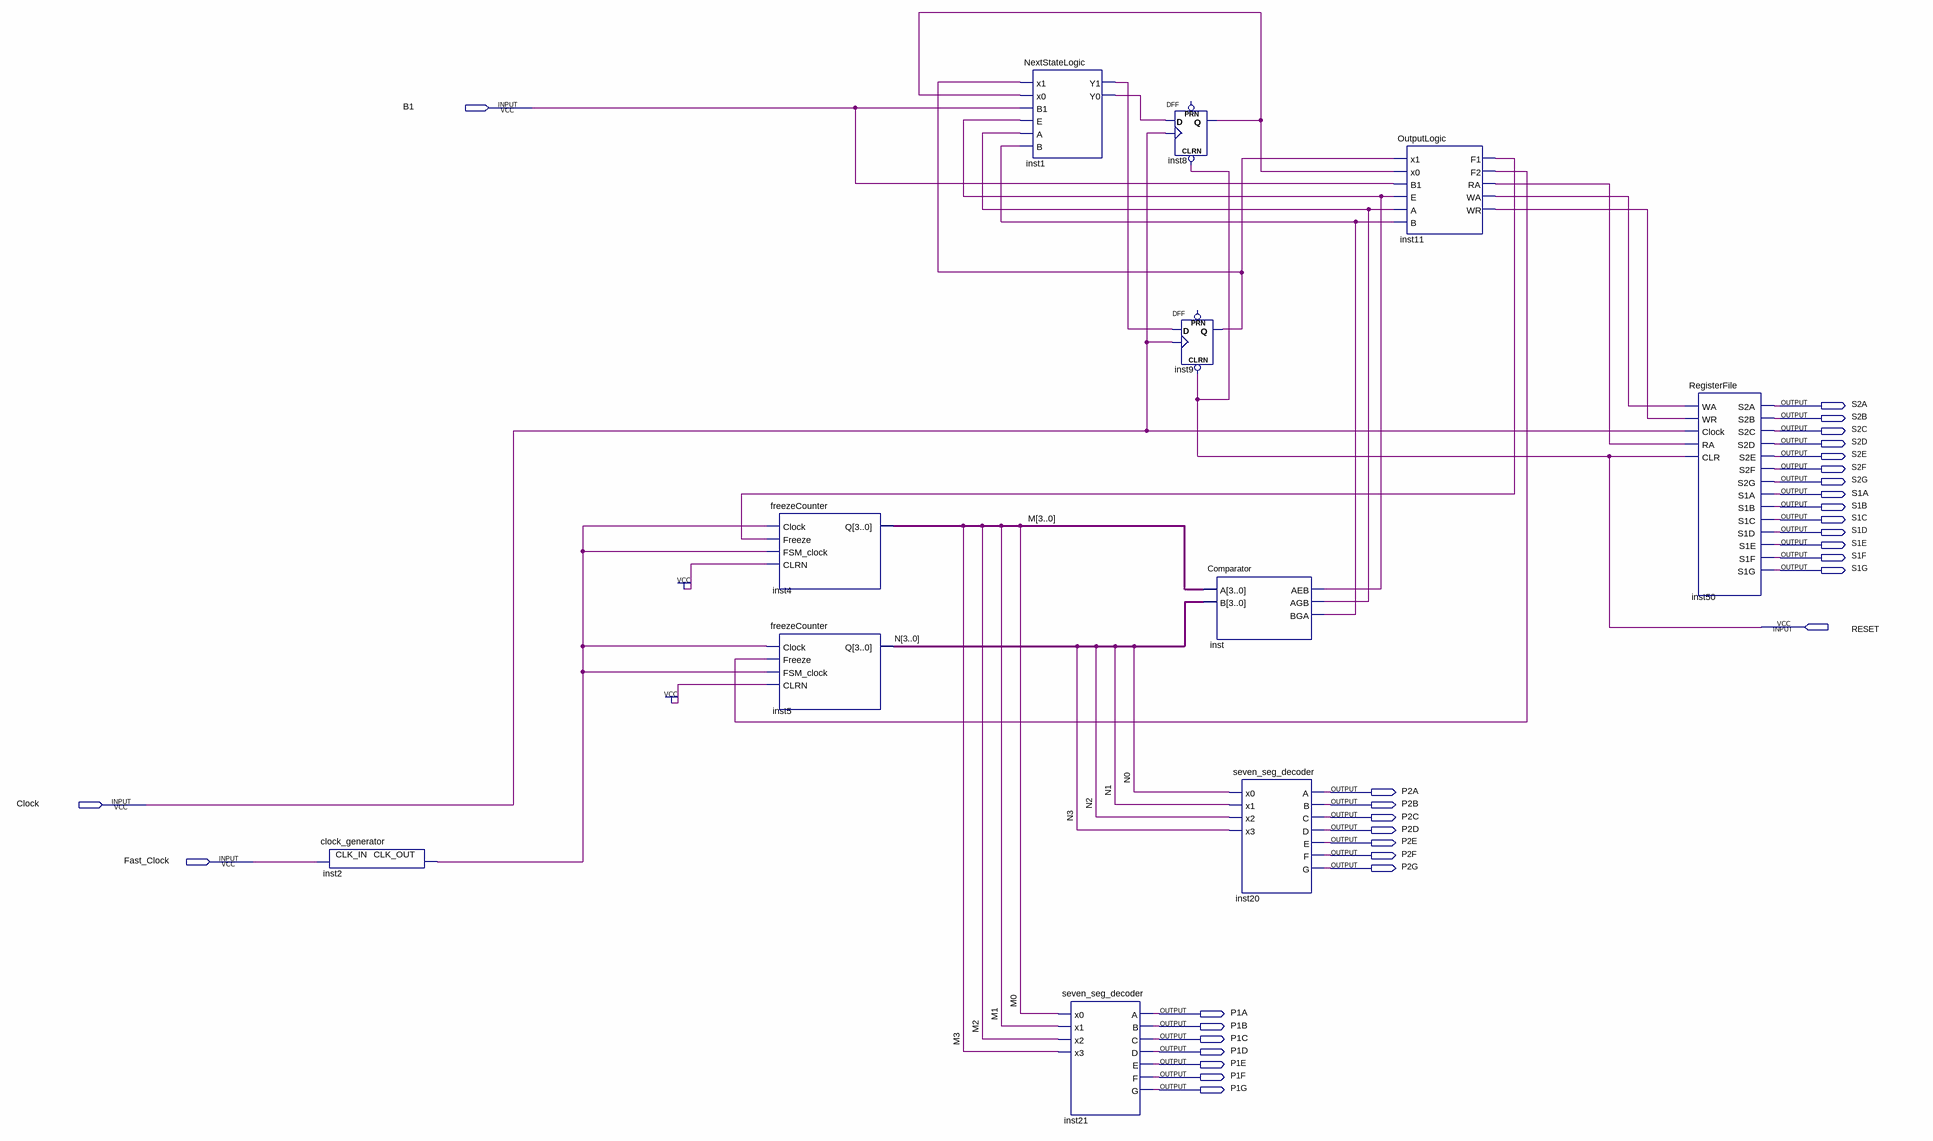
[diagram p0: schematic sheet]
// Quartus schematic Main.bdf as structural Verilog: 11 symbols, 32 pins
module Main (
  input  B1,
  input  RESET,
  input  Clock,
  input  Fast_Clock,
  output S2A,
  output S2B,
  output S2C,
  output S2D,
  output S2E,
  output S2F,
  output S2G,
  output S1A,
  output S1B,
  output S1C,
  output S1D,
  output S1E,
  output S1F,
  output S1G,
  output P2A,
  output P2B,
  output P2C,
  output P2D,
  output P2E,
  output P2F,
  output P2G,
  output P1A,
  output P1B,
  output P1C,
  output P1D,
  output P1E,
  output P1F,
  output P1G
);

  wire inst1_y0, inst1_y1, inst2_clk_out, inst8_q, inst9_q, inst11_f1, inst11_f2, inst11_ra, inst11_wa,
       inst11_wr, inst_aeb, inst_agb, inst_bga;
  wire [3:0] M, N;

  clock_generator inst2 (.CLK_IN(Fast_Clock), .CLK_OUT(inst2_clk_out));
  freezeCounter inst4 (.Clock(inst2_clk_out), .Freeze(inst11_f1), .FSM_clock(inst2_clk_out), .CLRN(1'b1), .Q(M));
  freezeCounter inst5 (.Clock(inst2_clk_out), .Freeze(inst11_f2), .FSM_clock(inst2_clk_out), .CLRN(1'b1), .Q(N));
  NextStateLogic inst1 (
    .x1(inst9_q), .x0(inst8_q), .B1(B1), .E(inst_aeb), .A(inst_agb), .B(inst_bga), .Y1(inst1_y1),
    .Y0(inst1_y0));
  seven_seg_decoder inst21 (
    .x0(M[0]), .x1(M[1]), .x2(M[2]), .x3(M[3]), .A(P1A), .B(P1B), .C(P1C), .D(P1D), .E(P1E), .F(P1F), .G(P1G));
  DFF inst8 (.CLRN(RESET), .CLK(Clock), .D(inst1_y0), .Q(inst8_q));  // open: PRN
  DFF inst9 (.CLRN(RESET), .CLK(Clock), .D(inst1_y1), .Q(inst9_q));  // open: PRN
  Comparator inst (.A(M), .B(N), .AEB(inst_aeb), .AGB(inst_agb), .BGA(inst_bga));
  seven_seg_decoder inst20 (
    .x0(N[0]), .x1(N[1]), .x2(N[2]), .x3(N[3]), .A(P2A), .B(P2B), .C(P2C), .D(P2D), .E(P2E), .F(P2F), .G(P2G));
  OutputLogic inst11 (
    .x1(inst9_q), .x0(inst8_q), .B1(B1), .E(inst_aeb), .A(inst_agb), .B(inst_bga), .F1(inst11_f1),
    .F2(inst11_f2), .RA(inst11_ra), .WA(inst11_wa), .WR(inst11_wr));
  RegisterFile inst50 (
    .WA(inst11_wa), .WR(inst11_wr), .Clock(Clock), .RA(inst11_ra), .CLR(RESET), .S2A(S2A), .S2B(S2B),
    .S2C(S2C), .S2D(S2D), .S2E(S2E), .S2F(S2F), .S2G(S2G), .S1A(S1A), .S1B(S1B), .S1C(S1C), .S1D(S1D),
    .S1E(S1E), .S1F(S1F), .S1G(S1G));
endmodule
